# EAGLE design ANIMA_Small_Scale (EAGLE 6.1)

## Sheet 1 of 2
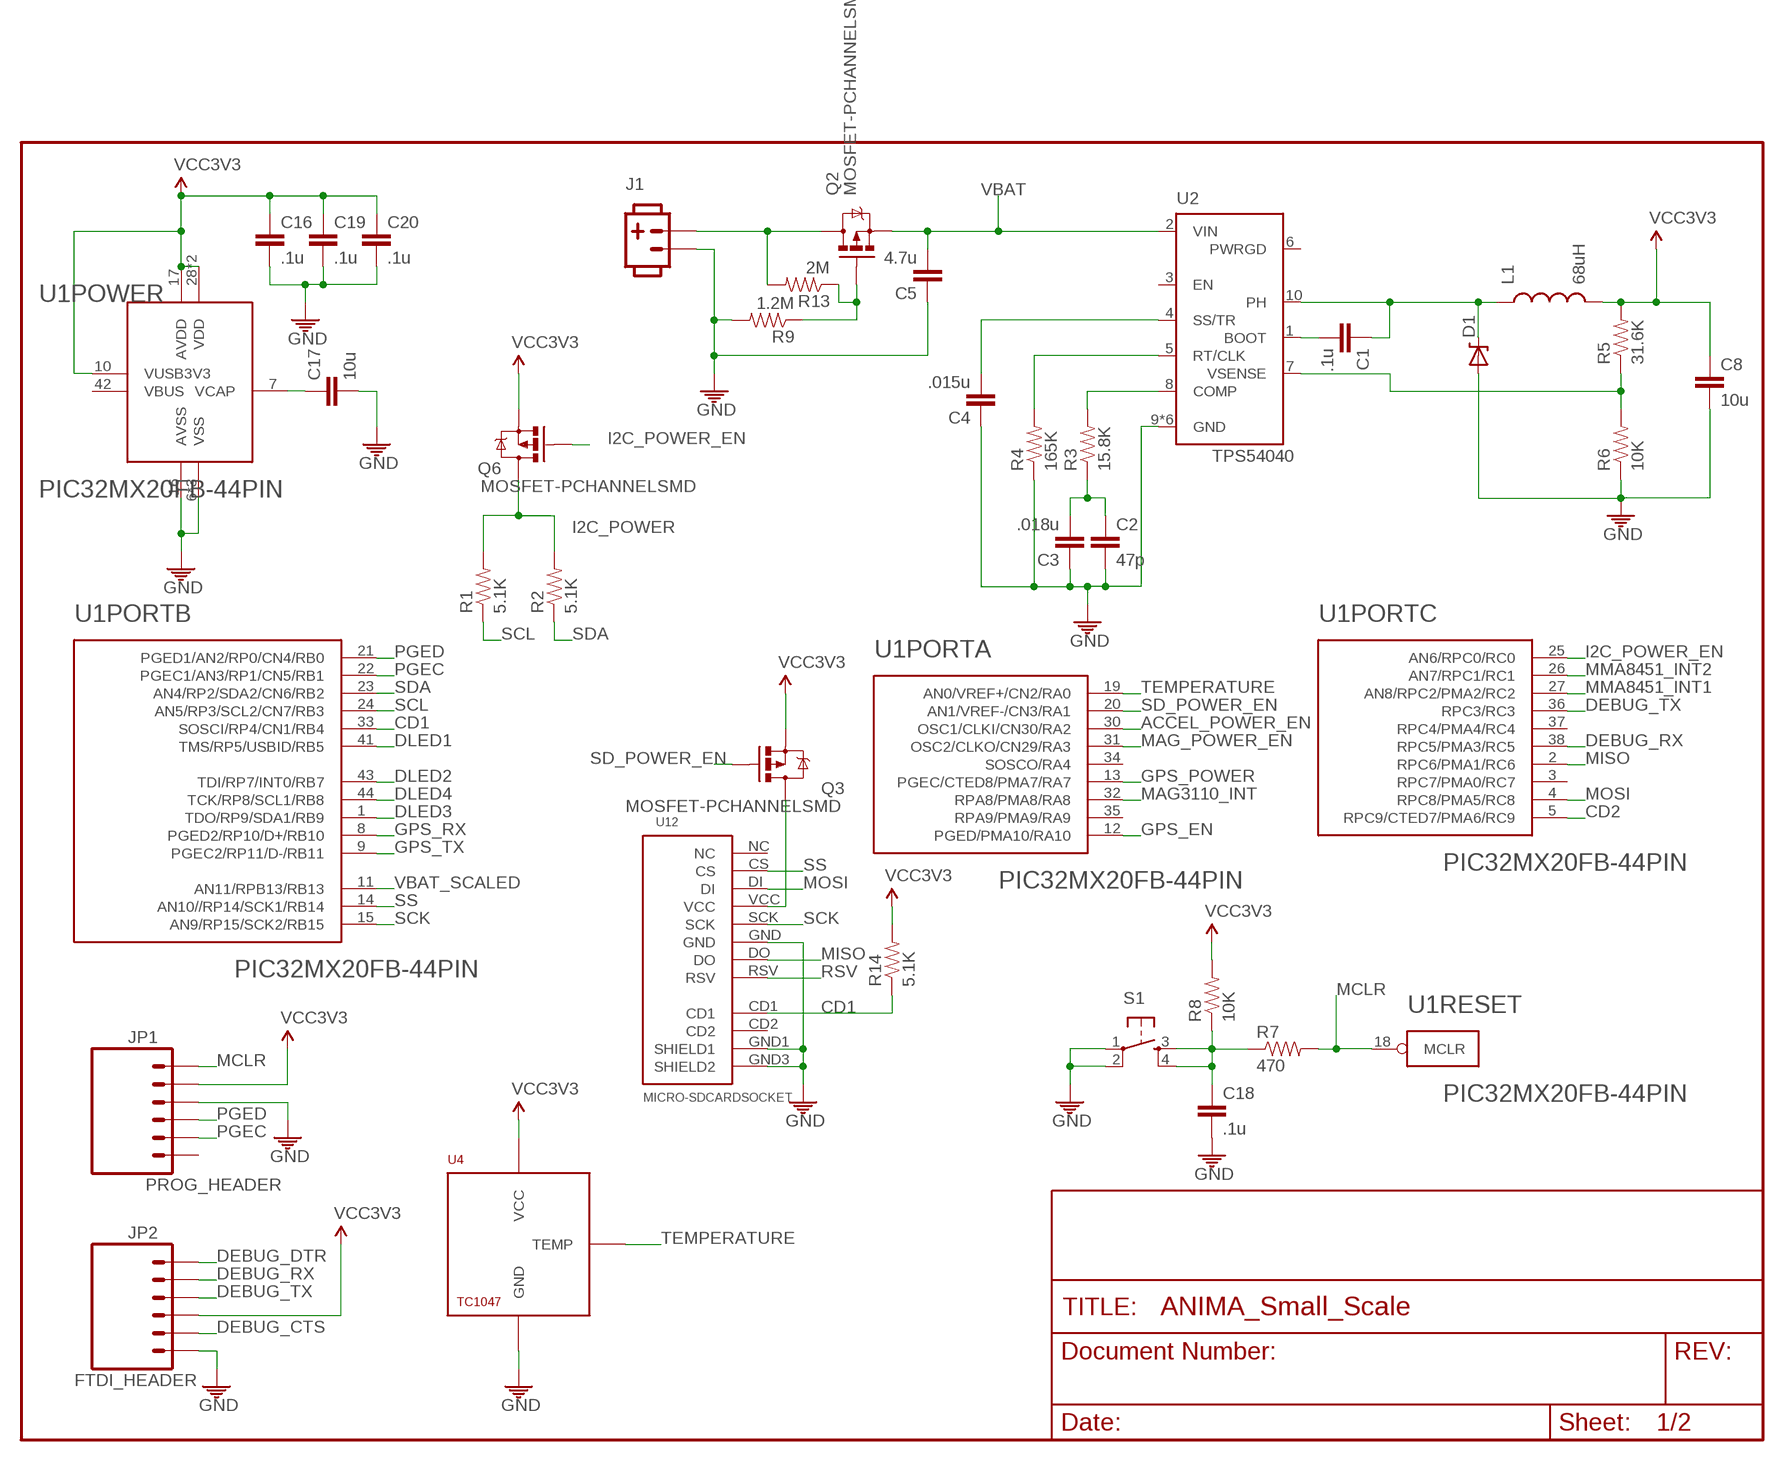
[diagram p0: schematic, sheet 1]

### Parts
C1  .1u  CAP0805  [0805]
C2  47p  CAP0805  [0805]
C3  .018u  CAP0805  [0805]
C4  .015u  CAP0805  [0805]
C5  4.7u  CAP0805  [0805]
C8  10u  CAP1206  [1206]
C16  .1u  CAP0805  [0805]
C17  10u  CAP0805  [0805]
C18  .1u  CAP0805  [0805]
C19  .1u  CAP0805  [0805]
C20  .1u  CAP0805  [0805]
D1  DIODE-ZENER1  [SOD523]
J1  POW_CONNECTFEMALE-RA  [SOCKET-FEMALE_RA-3.96MM-2]
JP1  M06FEMALE_LOCK  [1X06_FEMALE_LOCK.010]
JP2  M06FEMALE_LOCK  [1X06_FEMALE_LOCK.010]
L1  68uH  INDUCTORELL-CTVV  [ELL-CTVV]
Q2  MOSFET-PCHANNELSMD  [SOT23-3]
Q3  MOSFET-PCHANNELSMD  [SOT23-3]
Q6  MOSFET-PCHANNELSMD  [SOT23-3]
R1  5.1K  RESISTOR0805-RES  [0805]
R2  5.1K  RESISTOR0805-RES  [0805]
R3  15.8K  RESISTOR0805-RES  [0805]
R4  165K  RESISTOR0805-RES  [0805]
R5  31.6K  RESISTOR0805-RES  [0805]
R6  10K  RESISTOR0805-RES  [0805]
R7  470  RESISTOR0805-RES  [0805]
R8  10K  RESISTOR0805-RES  [0805]
R9  1.2M  RESISTOR0805-RES  [0805]
R13  2M  RESISTOR0805-RES  [0805]
R14  5.1K  RESISTOR0805-RES  [0805]
S1  TAC_SWITCHPTH  [B3F-1020]
U1  PIC32MX20FB-44PIN  [TQFP44]
U2  TPS54040  [MSOP-10-GNDPAD]
U4  TC1047  [SOT-23B]
U12  MICRO-SDCARDSOCKET  [MICRO-SD-SOCKET-PP]

### Nets
ACCEL_POWER_EN: U1.30(PORTA:OSC1/CLKI/CN30/RA2) ; also sheet 2
CD1: R14.1 U1.33(PORTB:SOSCI/RP4/CN1/RB4) U12.CD1
CD2: U1.5(PORTC:RPC9/CTED7/PMA6/RC9)
DEBUG_CTS: JP2.5
DEBUG_DTR: JP2.1
DEBUG_RX: JP2.2 U1.38(PORTC:RPC5/PMA3/RC5)
DEBUG_TX: JP2.3 U1.36(PORTC:RPC3/RC3)
DLED1: U1.41(PORTB:TMS/RP5/USBID/RB5) ; also sheet 2
DLED2: U1.43(PORTB:TDI/RP7/INT0/RB7) ; also sheet 2
DLED3: U1.1(PORTB:TDO/RP9/SDA1/RB9) ; also sheet 2
DLED4: U1.44(PORTB:TCK/RP8/SCL1/RB8) ; also sheet 2
GND: C2.2 C3.1 C4.1 C5.1 C8.2 C16.2 C17.2 C18.2 C19.2 C20.2 D1.-(A) J1.2 JP1.3 JP2.6 R4.1 R6.1 R9.2 S1.1 S1.2 U1.6(POWER:VSS) U1.16(POWER:AVSS) U1.29(POWER:VSS) U1.39(POWER:VSS) U2.9(GND) U2.GND U2.GND@1(GND) U2.GND@2(GND) U2.GND@3(GND) U2.GND@4(GND) U4.P$3(GND) U12.GND U12.GND1(SHIELD1) U12.GND3(SHIELD2) ; also sheet 2
GPS_EN: U1.12(PORTA:PGED/PMA10/RA10) ; also sheet 2
GPS_POWER: U1.13(PORTA:PGEC/CTED8/PMA7/RA7) ; also sheet 2
GPS_RX: U1.8(PORTB:PGED2/RP10/D+/RB10) ; also sheet 2
GPS_TX: U1.9(PORTB:PGEC2/RP11/D-/RB11) ; also sheet 2
I2C_POWER: Q6.3(D) R1.2 R2.2
I2C_POWER_EN: Q6.1(G) U1.25(PORTC:AN6/RPC0/RC0)
MAG3110_INT: U1.32(PORTA:RPA8/PMA8/RA8) ; also sheet 2
MAG_POWER_EN: U1.31(PORTA:OSC2/CLKO/CN29/RA3) ; also sheet 2
MCLR: JP1.1 R7.2 U1.18(RESET:MCLR)
MISO: U1.2(PORTC:RPC6/PMA1/RC6) U12.DO
MMA8451_INT1: U1.27(PORTC:AN8/RPC2/PMA2/RC2) ; also sheet 2
MMA8451_INT2: U1.26(PORTC:AN7/RPC1/RC1) ; also sheet 2
MOSI: U1.4(PORTC:RPC8/PMA5/RC8) U12.DI
N$4: C1.2 U2.1(BOOT)
N$5: C1.1 D1.+(C) L1.P$1 U2.10(PH)
N$6: C2.1 C3.2 R3.1
N$8: R3.2 U2.8(COMP)
N$9: C18.1 R7.1 R8.1 S1.3 S1.4
N$10: R5.1 R6.2 U2.7(VSENSE)
N$11: C17.1 U1.7(POWER:VCAP)
N$12: Q2.1(G) R9.1 R13.1
N$14: R4.2 U2.5(RT/CLK)
N$15: C4.2 U2.4(SS/TR)
N$20: J1.1 Q2.3(D) R13.2
N$22: Q3.3(D) U12.VCC
PGEC: JP1.5 U1.22(PORTB:PGEC1/AN3/RP1/CN5/RB1)
PGED: JP1.4 U1.21(PORTB:PGED1/AN2/RP0/CN4/RB0)
RSV: U12.RSV
SCK: U1.15(PORTB:AN9/RP15/SCK2/RB15) U12.SCK
SCL: R1.1 U1.24(PORTB:AN5/RP3/SCL2/CN7/RB3) ; also sheet 2
SD_POWER_EN: Q3.1(G) U1.20(PORTA:AN1/VREF-/CN3/RA1)
SDA: R2.1 U1.23(PORTB:AN4/RP2/SDA2/CN6/RB2) ; also sheet 2
SS: U1.14(PORTB:AN10//RP14/SCK1/RB14) U12.CS
TEMPERATURE: U1.19(PORTA:AN0/VREF+/CN2/RA0) U4.P$2(TEMP)
VBAT: C5.2 Q2.2(S) U2.2(VIN) ; also sheet 2
VBAT_SCALED: U1.11(PORTB:AN11/RPB13/RB13) ; also sheet 2
VCC3V3: C8.1 C16.1 C19.1 C20.1 JP1.2 JP2.4 L1.P$2 Q3.2(S) Q6.2(S) R5.2 R8.2 R14.2 U1.10(POWER:VUSB3V3) U1.17(POWER:AVDD) U1.28(POWER:VDD) U1.40(POWER:VDD) U4.P$1(VCC) ; also sheet 2
Unconnected: JP1.6 U1.3(PORTC:RPC7/PMA0/RC7) U1.34(PORTA:SOSCO/RA4) U1.35(PORTA:RPA9/PMA9/RA9) U1.37(PORTC:RPC4/PMA4/RC4) U1.42(POWER:VBUS) U2.3(EN) U2.6(PWRGD) U12.CD2 U12.NC

### Notes on the sheet
- PROG_HEADER
- FTDI_HEADER

## Sheet 2 of 2
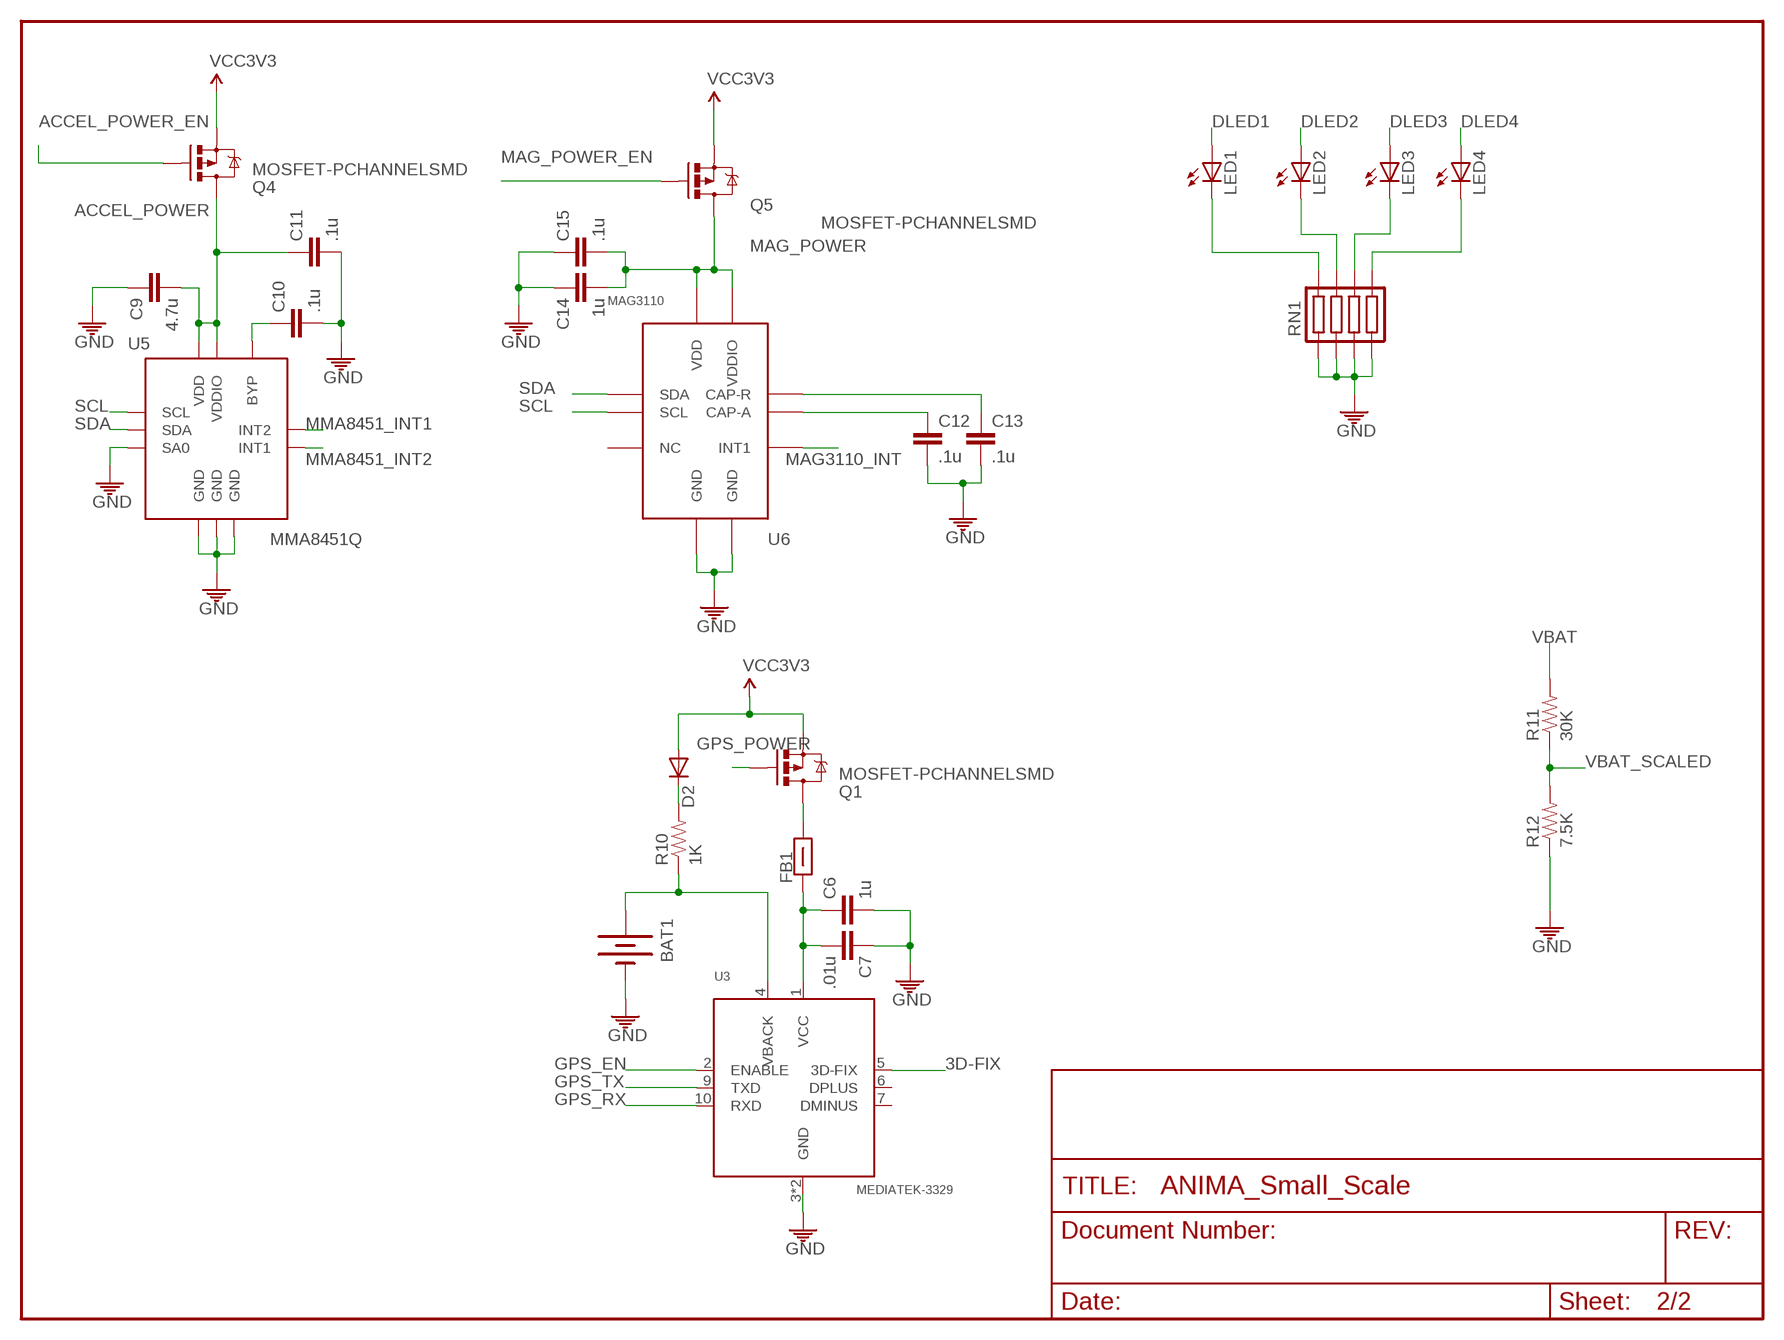
[diagram p1: schematic, sheet 2]

### Parts
BAT1  BATTERY4.8MMSMD  [MS412FE-FL26E]
C6  1u  CAP0805  [0805]
C7  .01u  CAP0805  [0805]
C9  4.7u  CAP0805  [0805]
C10  .1u  CAP0805  [0805]
C11  .1u  CAP0805  [0805]
C12  .1u  CAP0805  [0805]
C13  .1u  CAP0805  [0805]
C14  1u  CAP0805  [0805]
C15  .1u  CAP0805  [0805]
D2  DIODESMA  [SMA-DIODE]
FB1  FERRITE_BEAD  [0603]
LED1  LED1206  [LED-1206]
LED2  LED1206  [LED-1206]
LED3  LED1206  [LED-1206]
LED4  LED1206  [LED-1206]
Q1  MOSFET-PCHANNELSMD  [SOT23-3]
Q4  MOSFET-PCHANNELSMD  [SOT23-3]
Q5  MOSFET-PCHANNELSMD  [SOT23-3]
R10  1K  RESISTOR0805-RES  [0805]
R11  30K  RESISTOR0805-RES  [0805]
R12  7.5K  RESISTOR0805-RES  [0805]
RN1  RESISTOR_ARRAY-4  [EXB-38V271JV]
U3  MEDIATEK-3329  [MEDIATEK-3329]
U5  MMA8451Q  [QFN-16_FREE]
U6  MAG3110  [DFN-10_FREE]

### Nets
3D-FIX: U3.5(3D-FIX)
ACCEL_POWER: C9.2 C11.1 Q4.3(D) U5.P$1(VDDIO) U5.P$14(VDD)
ACCEL_POWER_EN: Q4.1(G) ; also sheet 1
DLED1: LED1.A ; also sheet 1
DLED2: LED2.A ; also sheet 1
DLED3: LED3.A ; also sheet 1
DLED4: LED4.A ; also sheet 1
GND: BAT1.- C6.2 C7.1 C9.1 C10.2 C11.2 C12.2 C13.2 C14.1 C15.1 R12.1 RN1.P$1 RN1.P$2 RN1.P$3 RN1.P$4 U3.3(GND) U3.8(GND) U5.P$5(GND) U5.P$7(SA0) U5.P$10(GND) U5.P$12(GND) U6.P$5(GND) U6.P$10(GND) ; also sheet 1
GPS_EN: U3.2(ENABLE) ; also sheet 1
GPS_POWER: Q1.1(G) ; also sheet 1
GPS_RX: U3.10(RXD) ; also sheet 1
GPS_TX: U3.9(TXD) ; also sheet 1
MAG3110_INT: U6.P$9(INT1) ; also sheet 1
MAG_POWER: C14.2 C15.2 Q5.3(D) U6.P$2(VDD) U6.P$8(VDDIO)
MAG_POWER_EN: Q5.1(G) ; also sheet 1
MMA8451_INT1: U5.P$9(INT2) ; also sheet 1
MMA8451_INT2: U5.P$11(INT1) ; also sheet 1
N$1: C10.1 U5.P$2(BYP)
N$2: C13.1 U6.P$4(CAP-R)
N$3: C6.1 C7.2 FB1.1 U3.1(VCC)
N$7: C12.1 U6.P$1(CAP-A)
N$13: LED4.C RN1.P$5
N$16: LED3.C RN1.P$6
N$17: LED1.C RN1.P$8
N$18: BAT1.+ R10.1 U3.4(VBACK)
N$19: LED2.C RN1.P$7
N$21: FB1.2 Q1.3(D)
N$23: D2.C R10.2
SCL: U5.P$4(SCL) U6.P$7(SCL) ; also sheet 1
SDA: U5.P$6(SDA) U6.P$6(SDA) ; also sheet 1
VBAT: R11.2 ; also sheet 1
VBAT_SCALED: R11.1 R12.2 ; also sheet 1
VCC3V3: D2.A Q1.2(S) Q4.2(S) Q5.2(S) ; also sheet 1
Unconnected: U3.6(DPLUS) U3.7(DMINUS) U6.P$3(NC)

## Library data of the parts
BAT1 = ANIMAlib:BATTERY: Battery Holders Various common sizes : AA, AAA, 20mm coin cell and 12mm coin cell. 20MM_4LEGS, BATT-10373
C1-C20 = ANIMAlib:CAP: Capacitor Standard 0603 ceramic capacitor, and 0.1" leaded capacitor.
D1 = ANIMAlib:DIODE-ZENER: Zener Diode Production Part - 8199 3.4V Zener Voltage
D2 = ANIMAlib:DIODE: Diode These are standard reverse protection diodes and small signal diodes. SMA package can handle up to about 1A. SOD-323 can handle about 200mA. What the SOD-323 package when ordering, there are some mfgs out there that are 5-pin packages.
FB1 = ANIMAlib:FERRITE_BEAD
J1 = ANIMAlib:POW_CONNECT
JP1 JP2 = ANIMAlib:M06: Header 6 Standard 6-pin 0.1" header. Use with straight break away headers (SKU : PRT-00116), right angle break away headers (PRT-00553), swiss pins (PRT-00743), machine pins (PRT-00117), and female headers (PRT-00115). Molex polarized connector foot print use with SKU : PRT-08094 with associated crimp pins and housings. NOTES ON THE VARIANTS LOCK and LOCK_LONGPADS... This footprint was designed to help hold the alignment of a through-hole component (i.e. 6-pin header) while soldering it into place. You may notice that each hole has been shifted either up or down by 0.005 of an inch from it's more standard position (which is a perfectly straight line). This slight alteration caused the pins (the squares in the middle) to touch the edges of the holes. Because they are alternating, it causes a "brace" to hold the component in place. 0.005 has proven to be the perfect amount of "off-center" position when using our standard breakaway headers. Although looks a little odd when you look at the bare footprint, once you have a header in there, the alteration is very hard to notice. Also, if you push a header all the way into place, it is covered up entirely on the bottom side. This idea of altering the position of holes to aid alignment will be further integrated into the Sparkfun Library for other footprints. It can help hold any component with 3 or more connection pins.
L1 = ANIMAlib:INDUCTOR: Inductors Basic Inductor/Choke - 0603 and 1206. Footprints are not proven and vary greatly between part numbers.
LED1-LED4 = ANIMAlib:LED: LEDs Standard schematic elements and footprints for 5mm, 3mm, 1206, and 0603 sized LEDs. 5mm - Spark Fun Electronics SKU : COM-00529 (and others)
Q1-Q6 = ANIMAlib:MOSFET-PCHANNEL: Generic PMOSFET
R1-R14 = ANIMAlib:RESISTOR: Resistor Basic schematic elements and footprints for 0603, 1206, and PTH resistors.
RN1 = ANIMAlib:RESISTOR_ARRAY-4: Chip Resistor Array 4 Single Resistor Source: http://industrial.panasonic.com/www-data/pdf/AOC0000/AOC0000PE2.pdf; OC_FARNELL: unknown; OC_NEWARK: unknown
S1 = ANIMAlib:TAC_SWITCH: Momentary Switch Button commonly used for reset or general input. Spark Fun Electronics SKU : COM-00097
U1 = ANIMAlib:PIC32MX2*0F***B-44PIN
U2 = ANIMAlib:TPS54040
U3 = ANIMAlib:MEDIATEK-3329
U4 = ANIMAlib:TC1047: The TC1047 is a linear output temperature sensor whose output voltage is directly proportional to measured temperature. The TC1047 can accurately measure temperature from -40C to +125C. For the TC1047, the output voltage range is typically 100mV at -40C, 500mV at 0C, 750mV at +25C, and 1.75V at +125C. A 10mV/¢XC voltage slope allows for the wide temperature range. The TC1047 is packaged in space saving 3-Pin SOT-23B packages, making them ideal for space critical applications.
U5 = ANIMAlib:MMA8451Q
U6 = ANIMAlib:MAG3110
U12 = ANIMAlib:MICRO-SDCARD

## Board
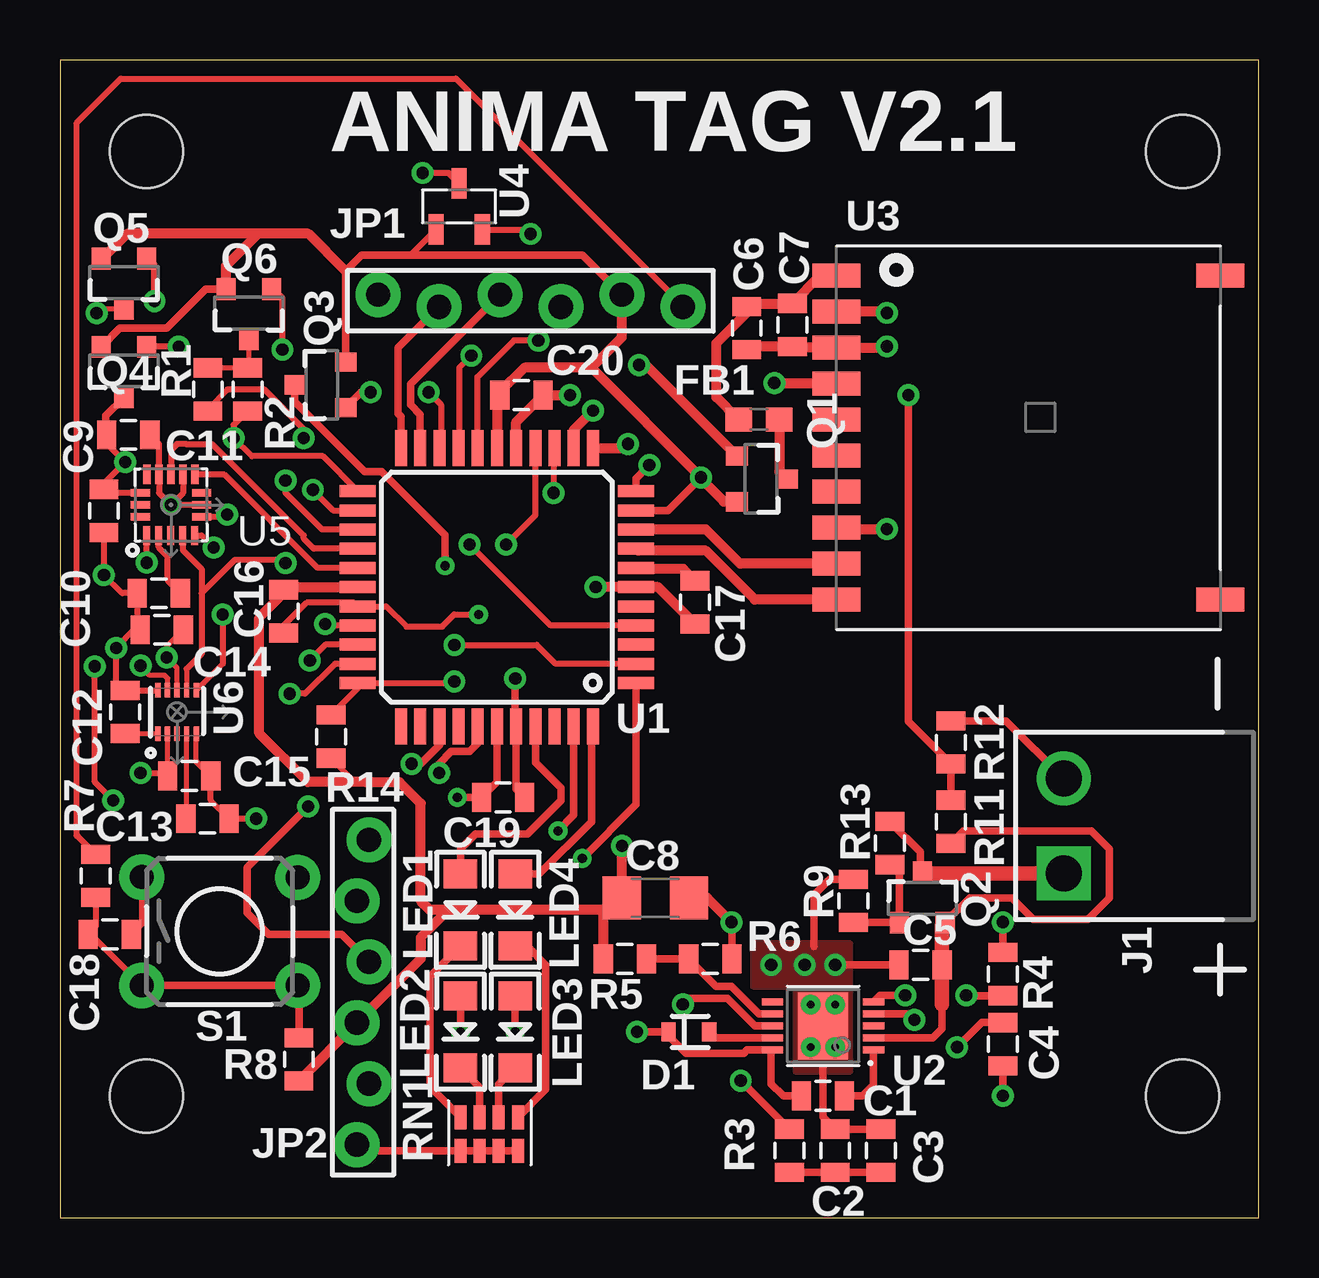
[diagram p2: board, top side]
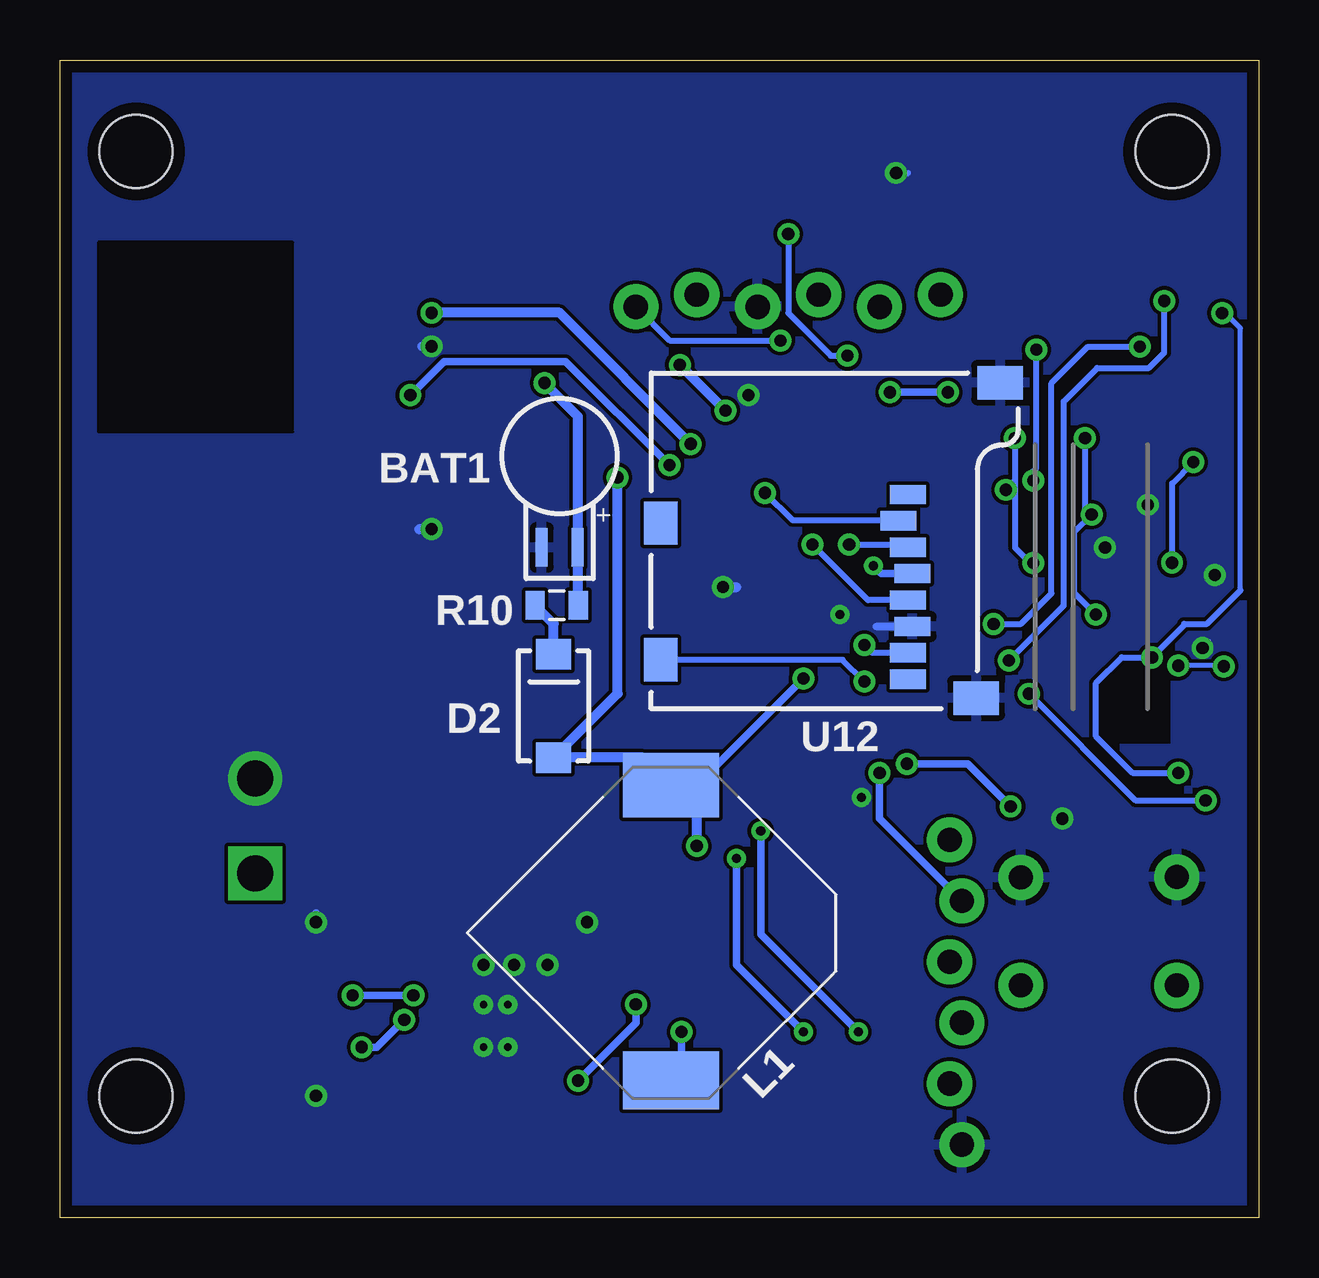
[diagram p3: board, bottom side, seen from below]

Size 49.97 x 48.27 mm. Coordinates in mm from the lower left corner, seen from the top.
Outline: 0,0 49.97,0.01 49.97,48.27 0,48.26 0,0
Copper layers (1*16): Top 0.035mm / dielectric 1.5mm / Bottom 0.035mm
Design rules: minimum track width 8mil, minimum drill 10mil, track to track 6mil, track to pad 6mil, pad to pad 6mil, via to via 6mil, smd to smd 6mil, copper to edge 0.5mm, drill to drill 8mil, minimum pad ring 10mil, minimum via ring 8mil, stop-mask expansion 4mil, vias tented up to drill 0mil, thermal gap 10mil

### Footprints (pad centres in the part's own frame; a part is rotated, then mirrored left to right if it is on the bottom)
MS412FE-FL26E = smd 1.6 x 0.5: + 0,0.75; - 0,-0.75
0805 = smd 0.8 x 1.2: 1 -0.9,0; 2 0.9,0
1206 = smd 1.6 x 1.8: 1 -1.4,0; 2 1.4,0
SOD523 = smd 0.6 x 0.8: + -0.85,0; - 0.85,0
SMA-DIODE = smd 1.27 x 1.47: A -2.15,0; C 2.15,0
0603 = smd 1.1 x 1: 1 -0.85,0; 2 0.85,0
SOCKET-FEMALE_RA-3.96MM-2 = drill 1.5 square: 1 0,0 | drill 1.5: 2 3.96,0
1X06_FEMALE_LOCK.010 = drill 1.016 pad 1.88: 1 0,0.254; 2 2.54,-0.254; 3 5.08,0.254; 4 7.62,-0.254; 5 10.16,0.254; 6 12.7,-0.254
ELL-CTVV = smd 4 x 2.4 rotated 135: P$1 -4.348,-4.348 | smd 4 x 2.7 rotated 135: P$2 4.348,4.348
LED-1206 = smd 1.2 x 1.4: A -1.5,0; C 1.5,0
SOT23-3 = smd 0.8 x 0.9: 1 -0.95,-1; 2 0.95,-1; 3 0,1.1
EXB-38V271JV = smd 0.5 x 1: P$1 0,0; P$2 0.8,0; P$3 1.6,0; P$4 2.4,0; P$5 2.4,1.4; P$6 1.6,1.4; P$7 0.8,1.4; P$8 0,1.4
B3F-1020 = drill 1 pad 1.88: 1 -3.25,2.261; 2 3.25,2.25; 3 -3.25,-2.261; 4 3.25,-2.25
STAND-OFF-TIGHT = hole 3.048: 0,0
TQFP44 = smd 1.5 x 0.5: 1 -5.8,4; 2 -5.8,3.2; 3 -5.8,2.4; 4 -5.8,1.6; 5 -5.8,0.8; 6 -5.8,0; 7 -5.8,-0.8; 8 -5.8,-1.6; 9 -5.8,-2.4; 10 -5.8,-3.2; 11 -5.8,-4; 23 5.8,-4; 24 5.8,-3.2; 25 5.8,-2.4; 26 5.8,-1.6; 27 5.8,-0.8; 28 5.8,0; 29 5.8,0.8; 30 5.8,1.6; 31 5.8,2.4; 32 5.8,3.2; 33 5.8,4 | smd 0.5 x 1.5: 12 -4,-5.8; 13 -3.2,-5.8; 14 -2.4,-5.8; 15 -1.6,-5.8; 16 -0.8,-5.8; 17 0,-5.8; 18 0.8,-5.8; 19 1.6,-5.8; 20 2.4,-5.8; 21 3.2,-5.8; 22 4,-5.8; 34 4,5.8; 35 3.2,5.8; 36 2.4,5.8; 37 1.6,5.8; 38 0.8,5.8; 39 0,5.8; 40 -0.8,5.8; 41 -1.6,5.8; 42 -2.4,5.8; 43 -3.2,5.8; 44 -4,5.8
MSOP-10-GNDPAD = smd 0.305 x 0.889: 1 -1,-2.11; 2 -0.5,-2.11; 3 0,-2.11; 4 0.5,-2.11; 5 1,-2.11; 6 1,2.11; 7 0.5,2.11; 8 0,2.11; 9 -0.5,2.11; 10 -1,2.11 | smd 2.794 x 2.083: GND 0,0 | drill 0.305: GND@1 -0.889,0.508; GND@2 0.889,0.508; GND@3 0.889,-0.508; GND@4 -0.889,-0.508
MEDIATEK-3329 = smd 2 x 1: 1 -8,6.75; 2 -8,5.25; 3 -8,3.75; 4 -8,2.25; 5 -8,0.75; 6 -8,-0.75; 7 -8,-2.25; 8 -8,-3.75; 9 -8,-5.25; 10 -8,-6.75; 11 8,6.75; 12 8,-6.75
SOT-23B = smd 1.27 x 0.635: P$1 0.965,-0.965; P$2 0.965,0.965; P$3 -0.965,0
QFN-16_FREE = smd 0.8 x 0.3: P$1 -1.275,1.01; P$2 -1.275,0.51; P$3 -1.275,0.01; P$4 -1.275,-0.49; P$5 -1.275,-0.99; P$9 1.275,-1; P$10 1.275,-0.5; P$11 1.275,0; P$12 1.275,0.5; P$13 1.275,1 | smd 0.3 x 0.8: P$6 -0.5,-1.275; P$7 0,-1.275; P$8 0.5,-1.275; P$14 0.5,1.275; P$15 0,1.275; P$16 -0.5,1.275
DFN-10_FREE = smd 0.6 x 0.225: P$1 -0.9,0.8; P$2 -0.9,0.4; P$3 -0.9,0; P$4 -0.9,-0.4; P$5 -0.9,-0.8; P$6 0.9,-0.8; P$7 0.9,-0.4; P$8 0.9,0; P$9 0.9,0.4; P$10 0.9,0.8
MICRO-SD-SOCKET-PP = smd 1.8 x 1.4: CD1 -2.05,0.4; CD2 -7.75,0.4 | smd 0.8 x 1.5: CS -7.84,10.3; DI -6.74,10.7; DO -2.34,10.7; GND -3.44,10.9; NC -8.94,10.7; RSV -1.24,10.7; SCK -4.54,10.7; VCC -5.64,10.9 | smd 1.4 x 1.9: GND1 -13.6,14.55; GND3 -0.45,13.55

### Placement (x,y rotation side)
BAT1  29.14,27.95 270 bottom
C1  31.8,5.09 0 top
C2  32.31,2.8 90 top
C3  34.22,2.8 270 top
C4  39.3,7.25 90 top
C5  35.87,10.55 0 top
C6  28.63,37.09 270 top
C7  30.53,37.22 90 top
C8  24.82,13.35 0 top
C9  1.83,29.47 90 top
C10  4.12,26.05 180 top
C11  2.85,32.65 0 top
C12  2.72,21.09 90 top
C13  6.15,16.65 0 top
C14  4.25,24.52 0 top
C15  5.39,18.43 180 top
C16  9.32,25.28 270 top
C17  26.47,25.66 270 top
C18  2.08,11.82 0 top
C19  18.47,17.54 180 top
C20  19.23,34.3 0 top
D1  26.22,7.76 0 top
D2  29.39,21.35 90 bottom
FB1  29.14,33.28 0 top
J1  41.84,14.36 90 top
JP1  25.96,38.24 180 top
JP2  12.63,15.76 270 top
L1  24.51,11.89 45 bottom
LED1  16.69,12.84 270 top
LED2  16.69,7.76 270 top
LED3  18.98,7.76 270 top
LED4  18.98,12.84 270 top
Q1  29.22,30.81 270 top
Q2  35.94,13.32 0 top
Q3  10.91,34.73 90 top
Q4  2.67,35.31 180 top
Q5  2.67,38.99 180 top
Q6  7.87,37.72 180 top
R1  6.17,34.53 90 top
R2  7.82,34.53 90 top
R3  30.41,2.8 90 top
R4  39.3,10.17 270 top
R5  23.55,10.8 180 top
R6  27.11,10.8 180 top
R7  1.49,14.26 90 top
R8  9.96,6.61 270 top
R9  33.07,13.22 90 top
R10  29.26,25.54 180 bottom
R11  37.14,16.52 270 top
R12  37.14,19.82 270 top
R13  34.6,15.63 90 top
R14  11.3,20.07 270 top
RN1  16.69,2.8 0 top
S1  6.66,11.95 0 top
ST1  [STAND-OFF-TIGHT]  3.61,5.09 0 top
ST2  [STAND-OFF-TIGHT]  3.61,44.46 0 top
ST3  [STAND-OFF-TIGHT]  46.79,44.46 0 top
ST4  [STAND-OFF-TIGHT]  46.79,5.09 0 top
U1  PIC32MX20F***B-44PIN  [TQFP44]  18.21,26.3 180 top
U2  31.8,8.01 90 top
U3  40.37,32.52 0 top
U4  16.64,42.16 270 top
U5  4.63,29.73 90 top
U6  4.88,21.09 90 top
U12  25.33,21.22 270 bottom

### Tracks (layer width: path | path; a pad name or v marks a point on that pad's centre or on a via)
ACCEL_POWER  (via drill 0.51 pad 0.41)
  Top 0.254: 1.95,30.49 C9.2 | v3.61,27.32 v3.62,27.32 U5.P$1 | C9.2 | U5.P$14 1.98,30.23 C9.2 | C11.1 1.96,32.27 v2.72,31.51 1.83,30.62 C9.2
  Top 0.305: Q4.3 1.91,33.44 1.91,32.51 1.95,32.55 C11.1
  Bottom 0.254: v3.61,27.32 3.61,30.62 v2.72,31.51
ACCEL_POWER_EN  (via drill 0.51)
  Top 0.254: U1.30 11.12,24.7 v11.05,24.77 | v4.95,36.32 3.63,36.32 Q4.1
  Bottom 0.254: v4.95,36.32 7.11,36.32 8.64,34.8 8.64,26.04 9.91,24.77 v11.05,24.77
CD1  (via drill 0.51 pad 0.41)
  Top 0.254: v16.44,22.36 16.37,22.3 U1.33 12.41,22.08 R14.1
  Bottom 0.254: v16.44,22.36 17.34,23.27 U12.CD1
DEBUG_RX  (via drill 0.51 pad 0.41)
  Top 0.305: U1.38 17.41,19.78 17.07,19.44 16.31,19.44 15.8,18.93 v15.8,18.55
  Bottom 0.305: JP2.2 15.8,16.65 v15.8,18.55
DEBUG_TX  (via drill 0.51 pad 0.41)
  Top 0.305: U1.36 15.81,19.71 15.04,18.93 v14.66,18.93 | v10.34,17.16 7.8,14.62 7.8,12.71 8.69,11.82 11.74,11.82 JP2.3
  Bottom 0.305: v14.66,18.93 12.12,18.93 v10.34,17.16
DLED1
  Top 0.305: U1.41 19.82,18.98 20.88,17.92 20.88,17.41 19.48,16.01 17.33,16.01 16.69,15.38 LED1.A 16.69,14.23
DLED2  (via drill 0.38 pad 0.41)
  Top 0.305: U1.43 21.41,16.8 v20.75,16.14 | v16.69,7.76 LED2.A
  Bottom 0.305: v20.75,16.14 20.75,11.82 v16.69,7.76
DLED3  (via drill 0.38 pad 0.41)
  Top 0.305: U1.1 24.02,17.24 v21.77,15 | v18.98,7.76 LED3.A
  Bottom 0.305: v21.77,15 21.77,10.55 v18.98,7.76
DLED4
  Top 0.305: LED4.A 19.97,14.34 22.15,16.52 22.15,20.44 U1.44
GND  (via drill 0.38 pad 0.41, 0.51, 0.51 pad 0.41)
  Top 0.203: 5.68,19.03 U6.P$5
  Top 0.254: U6.P$10 C12.2 2.34,22.37 v2.34,23.76 3.1,24.52 C14.1 3.22,24.65 C10.2 2.59,26.05 v1.83,26.81 C9.1 | 5.68,19.03 C15.1 6.29,17.41 C13.2 v8.18,16.65 | C11.2 3.74,32.65 4.13,32.26 U5.P$12 4.13,30.23 v4.63,29.73 | U5.P$10 5.13,30.23 v4.63,29.73 | U5.P$7 v4.63,29.73 | U5.P$5 5.9,28.45 v6.4,27.95 | 9.32,24.65 C16.2 9.32,24.69 10.29,25.65 12.26,25.65 U1.29 13.59,25.5 14.44,24.65 15.93,24.65 16.44,25.16 v17.45,25.16 | S1.1 3.41,12.25 C18.2 | 32.63,28.71 32.43,28.71 U3.8 | U4.P$3 16.2,43.56 v15.11,43.56
  Top 0.305: C5.1 32.44,10.55 32.31,10.42 | R6.1 28,12.32 v27.99,12.33 | R9.2 32.07,14.12 31.42,13.47 31.42,11.31 | R4.1 v39.3,12.33 | C4.1 v39.3,5.09 | U2.9 27.35,7.51 27.11,7.76 D1.- | C3.1 C2.2 31.8,4.21 31.8,6.23 | J1.2 39.44,20.72 R12.1 | RN1.P$4 RN1.P$3 RN1.P$2 RN1.P$1 12.63,2.8 JP2.6 | C7.1 30.53,36.33 | U1.39 18.21,18.17 C19.2 | C19.2 17.58,17.41 | C19.2 v16.56,17.54
  Top 0.406: C8.2 26.98,13.35 v27.99,12.33 | 32.63,28.71 v34.47,28.71 | v22.33,26.3 U1.6 24.93,26.3 C17.2 | U1.16 19.02,33.18 C20.2 v21.26,34.3 | 30.53,36.33 30.59,36.27 U3.3 34.41,36.27 v34.47,36.33 | C7.1 28.76,36.32 C6.2
  Bottom 0.254: 2.09,23.76 v2.34,23.76 2.09,24.01 | v1.83,26.81 1.83,27.06 | v4.63,29.73 4.75,29.6 | v6.4,27.95 6.53,27.82 | 14.44,24.65 U12.GND | v8.18,16.65 8.31,16.65 | v17.45,25.16 17.58,25.16 | v15.11,43.56 14.61,43.56
  Bottom 0.305: v27.99,12.33 27.99,12.58 | v39.3,12.33 39.3,12.71 | v39.3,5.09 39.3,4.96 | 15.93,24.65 14.4,24.65
  Bottom 0.406: v34.47,28.71 34.98,28.71 | v22.33,26.3 21.77,26.3 | v21.26,34.3 21.52,34.3 | v34.47,36.33 34.85,36.33
  other vias: 29.64,10.55 31.04,10.55 32.31,10.55
  pour Bottom: 0,0 49.46,0.01 49.71,49.16 0.25,49.15
  pour Top: 32.95,6.11 32.95,11.44 28.88,11.44 28.88,9.66 30.66,9.66 30.66,6.11
GPS_EN  (via drill 0.51 pad 0.41)
  Top 0.406: U1.12 23.51,32.1 v23.68,32.27 | v34.47,37.73 34.43,37.77 U3.2
  Bottom 0.406: v23.68,32.27 29.14,37.73 v34.47,37.73
GPS_POWER  (via drill 0.51)
  Top 0.406: U1.13 21.41,32.84 v22.23,33.66 | Q1.1 24.42,35.56 v24.13,35.56
  Bottom 0.406: v22.23,33.66 v24.13,35.56
GPS_RX
  Top 0.406: U3.10 28.96,25.77 26.92,27.81 24.1,27.81 U1.8 24.09,27.82
GPS_TX
  Top 0.406: 24.03,28.71 U1.9 24.13,28.7 26.92,28.7 28.35,27.27 U3.9
I2C_POWER
  Top 0.203: Q6.3 7.87,35.49 R2.2 R1.2
I2C_POWER_EN  (via drill 0.51)
  Top 0.203: 8.89,38.73 8.84,38.73 Q6.1
  Top 0.254: U1.25 11.69,28.7 11.68,28.7 10.92,28.7 9.4,30.23 v9.4,30.73 | v9.27,36.2 9.27,38.35 8.89,38.73
  Bottom 0.254: v9.4,30.73 9.4,31.11 9.27,31.24 v9.27,36.2
MAG3110_INT  (via drill 0.51 pad 0.41)
  Top 0.203: U6.P$9 4.5,22.01 4.5,22.49 4.37,22.62 3.74,22.62 3.36,23 v3.36,23.02
  Top 0.254: U1.32 11.46,23.1 10.21,21.85 v9.58,21.85 | v2.21,17.41 1.45,18.17 v1.45,23
  Bottom 0.203: v1.45,23 1.48,23.02 v3.36,23.02
  Bottom 0.254: v9.58,21.85 5.13,17.41 v2.21,17.41
MAG_POWER  (via drill 0.51, 0.51 pad 0.41)
  Top 0.203: C15.2 U6.P$2 | C14.2 4.45,23.82 v4.45,23.37 4.88,22.93 U6.P$8 | Q5.3 1.69,37.89 v1.52,37.72
  Top 0.254: C15.2 4.36,18.55 v3.36,18.55
  Bottom 0.203: 0.76,26.16 0.76,37.08 1.4,37.72 v1.52,37.72
  Bottom 0.254: v3.36,18.55 5.26,18.55 6.79,20.08 6.79,22.3 5.71,23.37 v4.45,23.37 3.11,24.7 3.11,24.77 2.16,24.77 0.76,26.16
MAG_POWER_EN  (via drill 0.51)
  Top 0.254: U1.31 11.07,23.9 v10.41,23.24 | v3.94,38.23 3.94,39.75 3.68,40.01 3.67,39.99 Q5.1
  Bottom 0.254: v10.41,23.24 8.13,25.53 8.13,34.04 6.73,35.43 4.57,35.43 3.94,36.07 v3.94,38.23
MCLR  (via drill 0.51)
  Top 0.254: R7.2 0.74,15.91 0.7,15.91 0.7,45.66 2.54,47.5 16.51,47.5 26.04,37.97 25.97,37.97 JP1.1 | U1.18 17.4,32.13 17.4,35.05 18.92,36.58 v19.94,36.58
  Top 0.305: U1.18 17.4,32.12 17.4,32.13
  Bottom 0.254: JP1.1 24.55,36.58 v19.94,36.58
MISO  (via drill 0.51 pad 0.41)
  Top 0.254: v16.44,23.89 19.87,23.89 20.63,23.12 23.99,23.12 U1.2
  Bottom 0.254: U12.DO 16.11,23.56 v16.44,23.89
MMA8451_INT1
  Top 0.254: 5.64,31.02 U5.P$9 5.7,31 5.71,30.99 | U1.27 10.75,27.1 6.86,30.99 5.71,30.99 | 5.71,30.99 5.59,30.99
MMA8451_INT2
  Top 0.254: 4.63,31.12 4.63,32.01 4.88,32.27 5.26,32.27 5.27,32.26 6.35,32.26 10.16,28.45 10.16,28.32 10.58,27.9 U1.26
  Top 0.305: 4.63,31.12 U5.P$11
MOSI  (via drill 0.51 pad 0.41)
  Top 0.254: U1.4 20.45,24.7 v17.07,28.08
  Bottom 0.254: v17.07,28.08 14.74,28.08 U12.DI
N$1
  Top 0.254: C10.1 4.5,26.56 4.5,27.57 4.12,27.95 U5.P$2
N$2
  Top 0.203: 5.28,16.68 U6.P$4
  Top 0.254: C13.1 5.28,16.68
N$3
  Top 0.406: FB1.1 27.36,34.21 27.36,36.46 28.63,37.73 C6.1 28.76,38.12 C7.2 31.68,39.27 U3.1
N$4
  Top 0.305: U2.1 33.91,5.55 33.45,5.09 C1.2
N$5  (via drill 0.51 pad 0.41)
  Top 0.305: v24.06,7.76 25.33,7.76 | 25.33,7.76 25.33,7.63 26.09,6.87 28.5,6.87 28.64,7.01 U2.10 29.64,6.96 29.64,5.6 30.15,5.09 C1.1 | D1.+ 25.33,7.76
  Bottom 0.305: 24.75,5.98 24.06,6.67 v24.06,7.76
  Bottom 0.406: 24.75,5.98 L1.P$1
N$6
  Top 0.305: C3.2 C2.1 R3.1
N$7
  Top 0.203: C12.1 U6.P$1
N$8  (via drill 0.51 pad 0.41)
  Top 0.305: U2.8 28.96,8.01 27.82,9.15 26.22,9.15 v25.96,8.9 | R3.2 v28.39,5.72 v28.38,5.72
  Bottom 0.305: v28.38,5.72 25.96,8.14 v25.96,8.9
N$9
  Top 0.254: R7.1 1.49,12.13 C18.1 1.27,11.82 S1.3
  Top 0.305: 2.81,9.69 S1.3 S1.4 9.96,9.65 R8.1
N$10
  Top 0.305: U2.7 29.14,8.51 27.99,9.66 27.35,9.66 R6.2 R5.1
N$11
  Top 0.406: C17.1 25.97,27.06 23.98,27.06 | U1.7 23.98,27.06 | 23.98,27.06 23.93,27.06
N$12
  Top 0.305: 33.19,12.32 Q2.1 34.99,14.34 R13.1 | 33.19,12.32 33.07,12.2 | 33.19,12.32 R9.1
N$13
  Top 0.305: RN1.P$5 20.25,5.36 20.25,10.55 19.46,11.34 LED4.C
N$14  (via drill 0.51 pad 0.41)
  Top 0.305: R4.2 37.78,9.27 v37.77,9.28 | v35.23,9.28 34.18,9.28 U2.5
  Bottom 0.305: v37.77,9.28 v35.23,9.28
N$15  (via drill 0.51 pad 0.41)
  Top 0.305: C4.2 38.42,8.15 v37.39,7.12 | v35.61,8.27 35.37,8.51 U2.4
  Bottom 0.305: v37.39,7.12 36.76,7.12 v35.61,8.27
N$16
  Top 0.305: LED3.C 18.29,5.57 RN1.P$6
N$17
  Top 0.305: RN1.P$8 15.42,5.47 15.42,10.07 LED1.C
N$18  (via drill 0.51 pad 0.41)
  Top 0.406: U3.4 29.81,34.77 v29.77,34.81
  Bottom 0.406: R10.1 28.36,27.95 | 28.36,27.95 28.36,28.07 28.38,28.08 28.38,33.41 v29.77,34.81 | BAT1.+ 28.36,27.95
N$19
  Top 0.305: LED2.C 17.49,5.46 RN1.P$7
N$20
  Top 0.305: Q2.3 35.93,14.42 35.87,14.36 35.87,15.25 R13.2
  Top 0.61: J1.1 35.99,14.36 35.99,14.37 Q2.3
N$21
  Top 0.305: 29.99,31.1 30.35,30.73 30.35,30.77 Q1.3
  Top 0.406: FB1.2 29.99,31.1
N$22  (via drill 0.38 pad 0.41)
  Top 0.305: v16.06,27.19 16.06,28.46 13.4,31.11 12.7,31.11 9.78,34.04 9.78,34.69 Q3.3
  Bottom 0.305: v16.06,27.19 15.73,26.86 U12.VCC
N$23
  Bottom 0.406: D2.C 29.39,24.76 R10.2
PGEC
  Top 0.305: JP1.5 14.1,36.28 14.1,33.53 14.21,33.41 U1.22
PGED
  Top 0.305: JP1.4 14.61,34.75 14.61,33.91 15.02,33.5 U1.21
SCK  (via drill 0.51 pad 0.41)
  Top 0.254: 19.74,32.14 19.87,32.01 19.87,32.05 U1.15 19.82,29.3 v18.6,28.08
  Bottom 0.254: U12.SCK 16.28,25.76 v18.6,28.08
SCL  (via drill 0.51)
  Top 0.203: 5.28,22.89 U6.P$7
  Top 0.254: U5.P$4 5.13,28.43 5.13,27.82 5.9,27.06 5.9,26.05 | 5.9,26.05 5.9,23.5 5.28,22.89 | 5.9,26.05 7.28,27.43 9.27,27.43 v9.4,27.3 | R1.1 6.17,33.73 6.99,34.54 8.51,34.54 10.16,32.89 v10.16,32.51 | v10.54,30.35 11.39,29.5 U1.24
  Bottom 0.254: v10.16,32.51 10.16,30.73 | 10.16,30.73 v10.54,30.35 | 10.16,30.73 10.16,27.94 9.53,27.3 v9.4,27.3
SD_POWER_EN  (via drill 0.51)
  Top 0.254: U1.20 15.88,32.16 | v15.37,34.42 15.88,33.91 15.88,32.26
  Top 0.305: v12.95,34.42 12.55,34.42 Q3.1 | 15.88,32.26 15.81,32.26 U1.20
  Bottom 0.305: v15.37,34.42 v12.95,34.42
SDA  (via drill 0.51, 0.51 pad 0.41)
  Top 0.203: 6.79,23.1 U6.P$6
  Top 0.254: v6.79,25.16 6.79,23.1 | U5.P$6 6.91,29.22 6.96,29.27 v6.96,29.32 | 7.87,33.66 7.85,33.63 R2.1 7.24,33.05 v7.24,32.51 8,31.75 10.96,31.75 U1.23
  Bottom 0.254: v6.79,25.16 7.67,26.05 7.67,28.61 v6.96,29.32 7.24,29.6 v7.24,32.51
SS  (via drill 0.51)
  Top 0.254: U1.14 20.57,32.06 v20.57,30.23
  Bottom 0.254: v20.57,30.23 19.43,29.08 14.99,29.08 15.01,29.06 U12.CS
TEMPERATURE  (via drill 0.51)
  Top 0.254: U4.P$2 19.43,41.2 v19.61,41.02 | v17.14,35.94 16.64,35.43 16.64,32.12 U1.19
  Bottom 0.254: v19.61,41.02 19.61,37.72 17.83,35.94 v17.14,35.94
VBAT
  Top 0.305: U2.2 33.92,7.5 36.38,7.5 36.76,7.88 36.76,8.9 36.77,8.91 | Q2.2 37.92,13.35 39.68,13.35 40.57,12.46 42.85,12.46 43.74,13.35 43.74,15.38 42.98,16.14 37.66,16.14 R11.2
  Top 0.61: 36.77,8.91 C5.2 36.77,12.19 Q2.2
VBAT_SCALED  (via drill 0.51 pad 0.41)
  Top 0.305: R11.1 R12.2 35.36,20.7 v35.36,34.3 | v24.57,31.38 24.02,30.83 U1.11
  Bottom 0.305: v35.36,34.3 33.96,35.7 28.88,35.7 v24.57,31.38
VCC3V3  (via drill 0.51 pad 0.41)
  Top 0.254: 9.65,26.29 9.4,26.29 9.4,26.26 C16.1 9.45,26.18 9.57,26.3 | U4.P$1 14.62,40.14 14.22,40.14 | R14.2 12.31,18.16 12.74,18.16 12.75,18.17
  Top 0.305: JP2.4 12.37,8.13 | v18.98,22.49 18.98,20.58 | 18.98,20.58 18.98,20.46 | 18.98,20.58 19.02,20.55 U1.40 19.02,17.89 C19.1 | U1.10 25.35,29.5 v26.72,30.87 26.73,30.86 26.73,30.8 | 23.3,38.62 23.3,38.49 JP1.2 21.77,40.14 14.22,40.14 12.58,40.14 11.91,39.47 Q3.2 | Q4.2 2.5,37.08 4.45,37.08 6.08,38.72 Q6.2
  Top 0.406: R5.2 22.65,12.57 22.91,12.84 | v23.42,15.5 C8.1 22.91,12.84 | v26.72,30.87 22.15,35.44 | 22.15,35.44 19.36,35.44 18.33,34.42 C20.1 18.21,34.18 U1.17 | 22.15,35.44 23.42,36.71 JP1.2 | C16.1 9.32,26.05 8.31,25.03 8.31,20.2 10.34,18.17 12.75,18.17 12.76,18.16 14.16,18.16 15.04,17.28 15.04,13.22 15.42,12.84 16.18,12.84 | 9.57,26.3 U1.28 | 12.37,8.13 R8.2 | JP2.4 15.04,10.8 15.04,11.69 16.18,12.84 | 22.91,12.84 16.18,12.84 | Q1.2 27.67,29.86 26.73,30.8 26.67,30.86 | 11.91,39.47 10.36,41.02 8.26,41.02 | 8.26,41.02 2.79,41.02 1.76,39.99 Q5.2 | Q6.2 6.92,39.69 8.26,41.02
  Bottom 0.305: 23.42,16.95 23.42,18.04 v18.98,22.49
  Bottom 0.406: v23.42,15.5 23.42,16.95 L1.P$2 25.66,19.2 D2.A 26.72,21.86 v26.72,30.87

### Text on the board
tPlace: ANIMA TAG V2.1